# EAGLE design 1 (EAGLE 9.3.0)
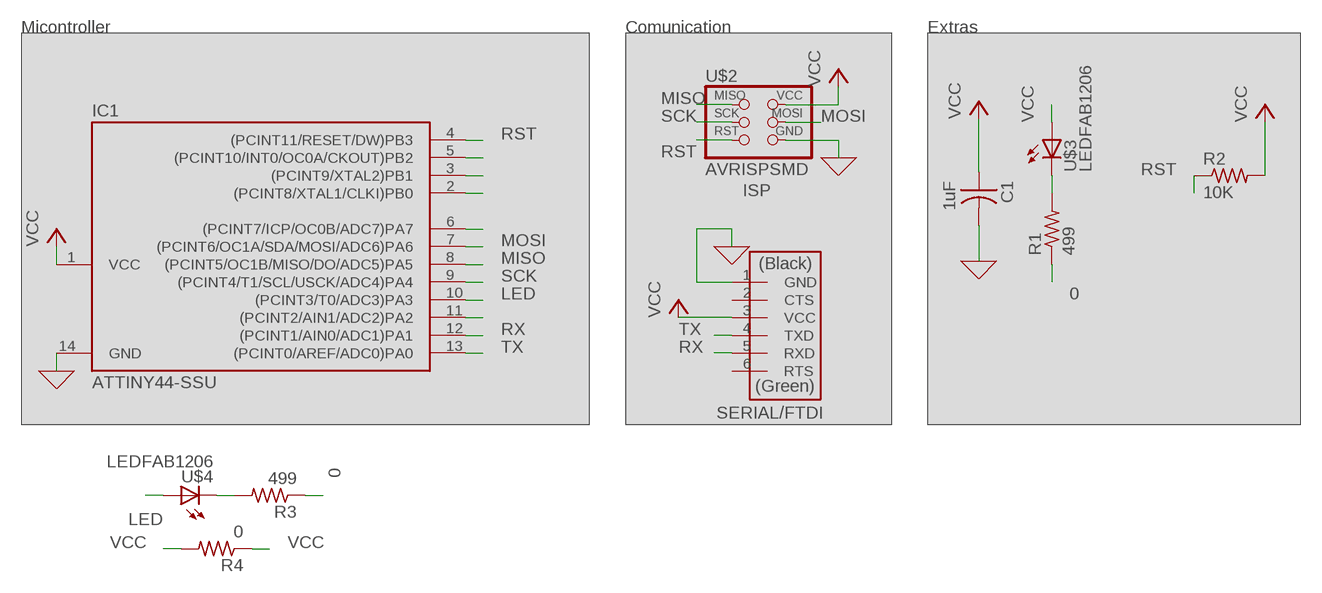
[diagram p0: schematic, sheet 1]

## Parts
C1  1uF  CAP-US1206FAB  [C1206FAB]
IC1  ATTINY44-SSU  [SOIC14]
R1  499  RES-US1206FAB  [R1206FAB]
R2  10K  RES-US1206FAB  [R1206FAB]
R3  499  RES-US1206FAB  [R1206FAB]
R4  0  RES-US1206FAB  [R1206FAB]
U$1  FTDI-SMD-HEADER  [1X06SMD]
U$2  AVRISPSMD  [2X03SMD]
U$3  LEDFAB1206  [LED1206FAB]
U$4  LEDFAB1206  [LED1206FAB]

## Nets
0: C1.2 IC1.14(GND) R1.1 R3.1 U$1.1(GND) U$2.6(GND) ; supply symbol labelled GND
LED: IC1.10((PCINT3/T0/ADC3)PA3) U$4.1(A)
MISO: IC1.6((PCINT7/ICP/OC0B/ADC7)PA7) IC1.8((PCINT5/OC1B/MISO/DO/ADC5)PA5) U$2.1(MISO)
MOSI: IC1.7((PCINT6/OC1A/SDA/MOSI/ADC6)PA6) U$2.4(MOSI)
N$1: R1.2 U$3.2(C)
N$2: R3.2 U$4.2(C)
N$5: IC1.5((PCINT10/INT0/OC0A/CKOUT)PB2)
N$6: IC1.3((PCINT9/XTAL2)PB1)
N$7: IC1.2((PCINT8/XTAL1/CLKI)PB0)
N$13: IC1.11((PCINT2/AIN1/ADC2)PA2)
RST: IC1.4((PCINT11/RESET/DW)PB3) R2.1 U$2.5(RST)
RX: IC1.12((PCINT1/AIN0/ADC1)PA1) U$1.5(RXD)
SCK: IC1.9((PCINT4/T1/SCL/USCK/ADC4)PA4) U$2.3(SCK)
TX: IC1.13((PCINT0/AREF/ADC0)PA0) U$1.4(TXD)
VCC: C1.1 IC1.1(VCC) R2.2 R4.1 R4.2 U$1.3(VCC) U$2.2(VCC) U$3.1(A)
Unconnected: U$1.2(CTS) U$1.6(RTS)

## Notes on the sheet
- Micontroller | Comunication | Extras
- ISP
- SERIAL/FTDI

## Library data of the parts
C1 = fab:CAP-US
IC1 = fab:ATTINY44
R1-R4 = fab:RES-US: Resistor (US Symbol) Variants with postfix FAB are widened to allow the routing of internal traces
U$1 = fab:FTDI-SMD-HEADER
U$2 = fab:AVRISP
U$3 U$4 = fab:LED: LED

## Board
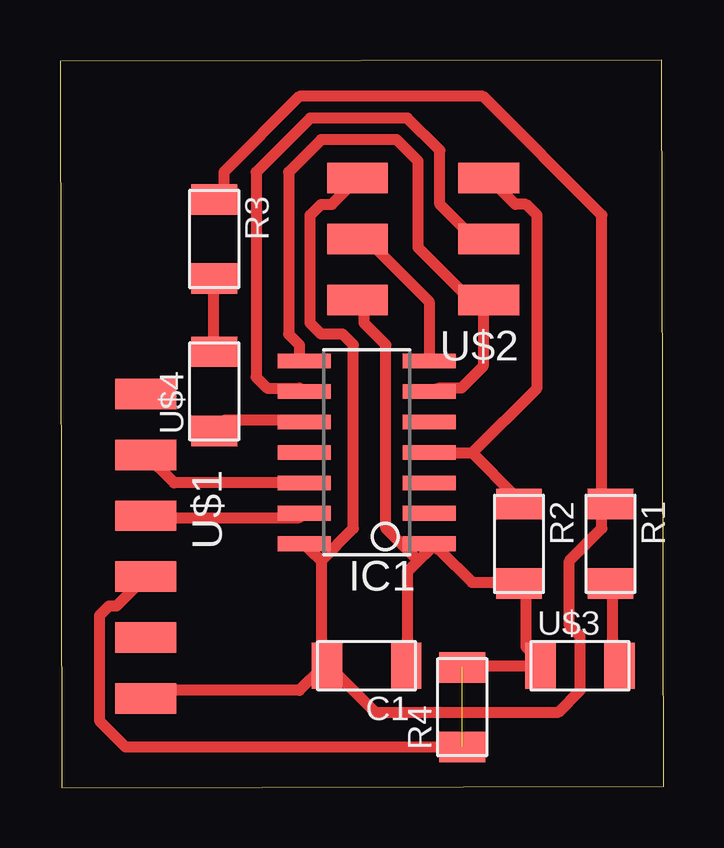
[diagram p1: board, top side]

Size 25.15 x 30.32 mm. Coordinates in mm from the lower left corner, seen from the top.
Outline: 0.08,0 25.15,0.05 25.07,30.32 0,30.27 0.08,0
Copper layers (1*16): Top 0.035mm / dielectric 1.5mm / Bottom 0.035mm
Design rules "default *": minimum track width 0.45mm, minimum drill 0.35mm, track to track 0.45mm, track to pad 0.45mm, pad to pad 0.45mm, via to via 0.45mm, smd to smd 0.45mm, copper to edge 40mil, drill to drill 6mil, minimum pad ring 10mil, minimum via ring 8mil, stop-mask expansion 4mil, vias tented up to drill 0mil, thermal gap 10mil

### Footprints (pad centres in the part's own frame; a part is rotated, then mirrored left to right if it is on the bottom)
C1206FAB = smd 1.27 x 1.905: 1 -1.651,0; 2 1.651,0
SOIC14 = smd 0.61 x 2.21: 1 -3.81,-2.603; 2 -2.54,-2.603; 3 -1.27,-2.603; 4 0,-2.603; 5 1.27,-2.603; 6 2.54,-2.603; 7 3.81,-2.603; 8 3.81,2.603; 9 2.54,2.603; 10 1.27,2.603; 11 0,2.603; 12 -1.27,2.603; 13 -2.54,2.603; 14 -3.81,2.603
R1206FAB = smd 1.27 x 1.905: 1 -1.651,0; 2 1.651,0
1X06SMD = smd 2.54 x 1.27: 1 0,6.35; 2 0,3.81; 3 0,1.27; 4 0,-1.27; 5 0,-3.81; 6 0,-6.35
2X03SMD = smd 2.54 x 1.27: 1 -2.54,2.54; 2 2.92,2.54; 3 -2.54,0; 4 2.92,0; 5 -2.54,-2.54; 6 2.92,-2.54
LED1206FAB = smd 1.27 x 1.905: 1 -1.651,0; 2 1.651,0

### Placement (x,y rotation side)
C1  12.78,5.08 180 top
IC1  12.78,13.97 90 top
R1  22.94,10.16 270 top
R2  19.13,10.16 270 top
R3  6.43,22.86 270 top
R4  16.76,3.35 90 top
U$1  3.58,10.06 180 top
U$2  15.32,22.86 180 top
U$3  21.67,5.08 0 top
U$4  6.43,16.51 90 top

### Tracks (layer width: path | path; a pad name or v marks a point on that pad's centre or on a via)
0
  Top 0.45: 10.88,9.45 10.88,5.4 C1.2 | 10.88,9.45 10.43,9.9 IC1.14 | C1.2 11.33,4.95 13.13,3.15 20.78,3.15 21.68,4.05 21.68,6.3 21.23,6.75 21.23,9.45 22.58,10.8 22.58,11.7 R1.1 22.58,12.15 22.58,23.85 17.63,28.8 9.98,28.8 6.83,25.65 6.83,24.75 R3.1 | U$1.1 3.81,4.05 9.98,4.05 10.88,4.95 C1.2 | 10.88,9.45 12.23,10.8 12.23,18.45 11.78,18.9 10.88,18.9 10.43,19.35 10.43,23.85 10.88,24.3 11.33,24.3 12.23,25.2 U$2.6
LED
  Top 0.45: U$4.1 6.83,15.3 9.98,15.3 IC1.10
MISO
  Top 0.45: IC1.8 9.98,18 9.98,18.45 9.53,18.9 9.53,25.65 10.88,27 14.03,27 14.93,26.1 14.93,22.5 16.73,20.7 17.63,20.7 U$2.1 17.63,20.25 17.63,17.55 16.73,16.65 15.83,16.65 IC1.6
MOSI
  Top 0.45: IC1.7 15.38,18 15.38,20.25 12.68,22.95 U$2.4
N$1
  Top 0.45: R1.2 23.03,8.1 23.03,5.4 U$3.2
N$2
  Top 0.45: U$4.2 6.38,18.45 6.38,21.15 R3.2
RST
  Top 0.45: 17.18,13.95 18.98,12.15 R2.1 | 17.18,13.95 15.83,13.95 IC1.4 | 17.18,13.95 19.88,16.65 19.88,23.85 19.43,24.3 18.98,24.3 18.08,25.2 U$2.5
RX
  Top 0.45: 9.98,12.6 IC1.12 4.76,12.7 U$1.5
SCK
  Top 0.45: IC1.9 9.98,16.65 8.63,16.65 8.18,17.1 8.18,25.65 10.43,27.9 14.48,27.9 15.83,26.55 15.83,24.3 17.63,22.5 U$2.3
TX
  Top 0.45: IC1.13 9.98,11.25 3.65,11.25 U$1.4
VCC  (1 unrouted)
  Top 0.45: 14.93,9.45 15.38,9.9 IC1.1 15.83,9.9 17.18,8.55 18.98,8.55 R2.2 19.43,8.1 19.43,5.85 19.88,5.4 U$3.1 16.84,5.08 R4.2 | 14.93,9.45 14.48,9 14.48,5.4 C1.1 | 14.93,9.45 13.58,10.8 13.58,18.45 12.68,19.35 12.68,20.25 U$2.2 | U$1.3 2.35,7.56 2.03,7.56 1.64,7.16 1.64,2.79 2.73,1.7 R4.1